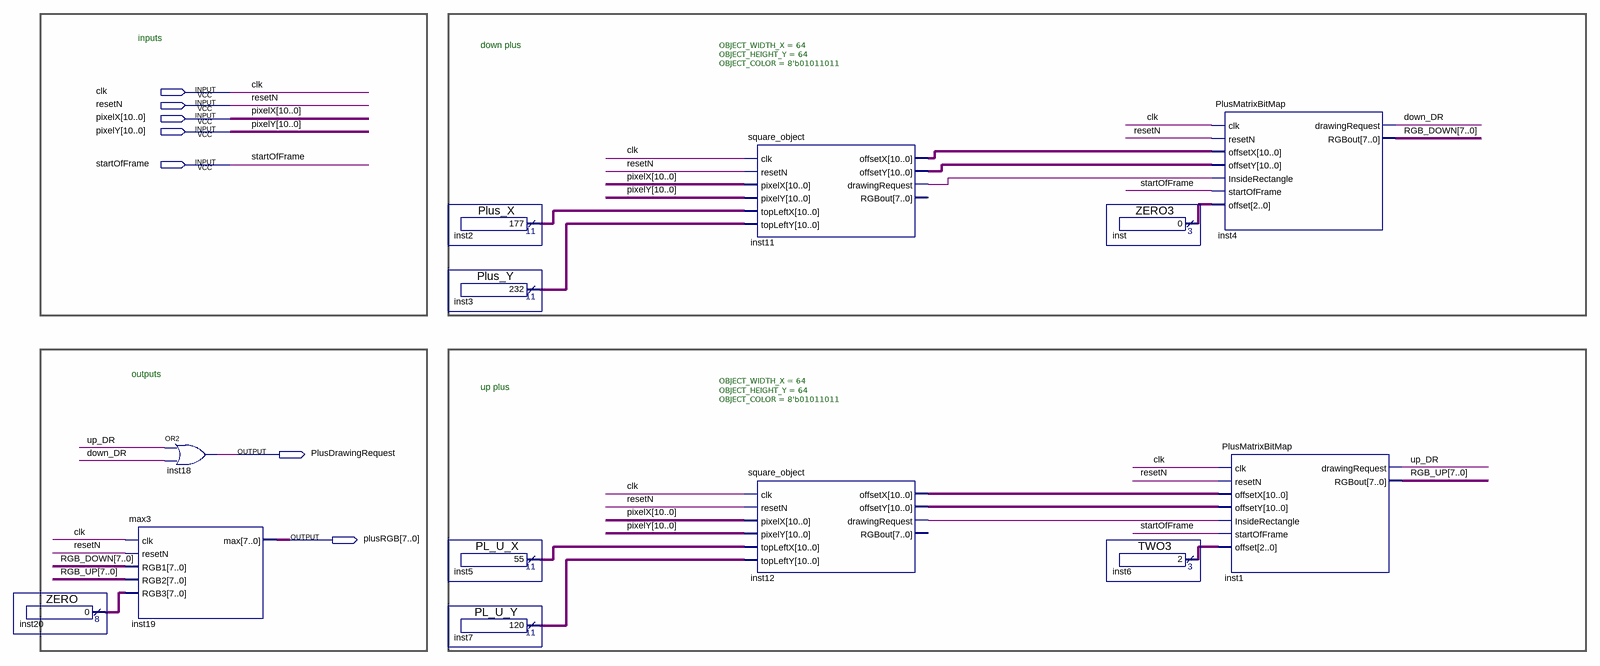
[diagram p0: schematic sheet]
// Quartus schematic PLUS_DISPLAY.bdf as structural Verilog: 13 symbols, 7 pins
module PLUS_DISPLAY (
  input  clk,
  input  resetN,
  input  [10:0] pixelX,
  input  [10:0] pixelY,
  input  startOfFrame,
  output PlusDrawingRequest,
  output [7:0] plusRGB
);

  wire down_DR, inst11_drawingrequest, inst12_drawingrequest, up_DR;
  wire [2:0] inst6_result, inst_result;
  wire [7:0] inst20_result, RGB_DOWN, RGB_UP;
  wire [10:0] inst2_result, inst3_result, inst5_result, inst7_result, inst11_offsetx, inst11_offsety,
       inst12_offsetx, inst12_offsety;

  ZERO inst20 (.result(inst20_result));
  max3 inst19 (.clk(clk), .resetN(resetN), .RGB1(RGB_DOWN), .RGB2(RGB_UP), .RGB3(inst20_result), .max(plusRGB));
  or inst18 (PlusDrawingRequest, up_DR, down_DR);
  Plus_X inst2 (.result(inst2_result));
  Plus_Y inst3 (.result(inst3_result));
  PL_U_X inst5 (.result(inst5_result));
  PL_U_Y inst7 (.result(inst7_result));
  square_object #(.OBJECT_WIDTH_X(64), .OBJECT_HEIGHT_Y(64), .OBJECT_COLOR(8'b01011011)) inst11 (
    .clk(clk), .resetN(resetN), .pixelX(pixelX), .pixelY(pixelY), .topLeftX(inst2_result),
    .topLeftY(inst3_result), .offsetX(inst11_offsetx), .offsetY(inst11_offsety),
    .drawingRequest(inst11_drawingrequest));  // open: RGBout
  square_object #(.OBJECT_WIDTH_X(64), .OBJECT_HEIGHT_Y(64), .OBJECT_COLOR(8'b01011011)) inst12 (
    .clk(clk), .resetN(resetN), .pixelX(pixelX), .pixelY(pixelY), .topLeftX(inst5_result),
    .topLeftY(inst7_result), .offsetX(inst12_offsetx), .offsetY(inst12_offsety),
    .drawingRequest(inst12_drawingrequest));  // open: RGBout
  ZERO3 inst (.result(inst_result));
  TWO3 inst6 (.result(inst6_result));
  PlusMatrixBitMap inst4 (
    .clk(clk), .resetN(resetN), .offsetX(inst11_offsetx), .offsetY(inst11_offsety),
    .InsideRectangle(inst11_drawingrequest), .startOfFrame(startOfFrame), .offset(inst_result),
    .drawingRequest(down_DR), .RGBout(RGB_DOWN));
  PlusMatrixBitMap inst1 (
    .clk(clk), .resetN(resetN), .offsetX(inst12_offsetx), .offsetY(inst12_offsety),
    .InsideRectangle(inst12_drawingrequest), .startOfFrame(startOfFrame), .offset(inst6_result),
    .drawingRequest(up_DR), .RGBout(RGB_UP));

  // Notes on the sheet:
  //   inputs
  //   down plus
  //   outputs
  //   up plus
endmodule
